# EAGLE design microcontroller (EAGLE 9.5.0)
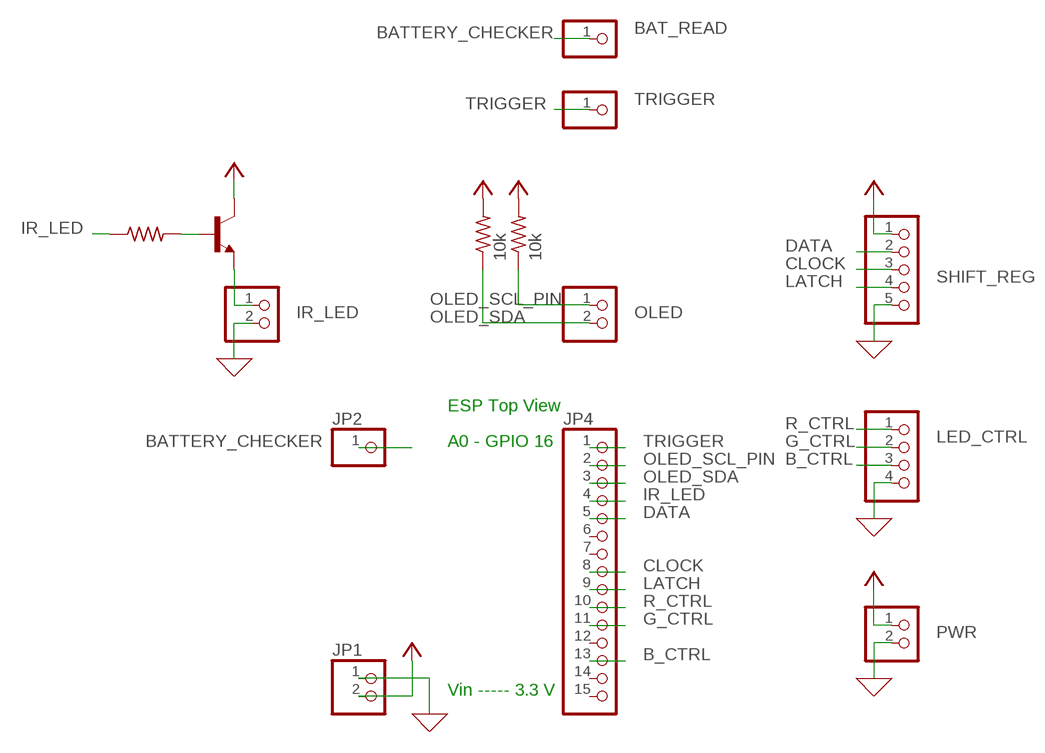
[diagram p0: schematic, sheet 1]

## Parts
BAT_READ  PINHD-1X1  [1X01]
IR_LED  PINHD-1X2  [1X02]
IR_TRS  2N5088  [TO92]
JP1  PINHD-1X2  [1X02]
JP2  PINHD-1X1  [1X01]
JP4  PINHD-1X15  [1X15]
LED_CTRL  PINHD-1X4  [1X04]
OLED  PINHD-1X2  [1X02]
PWR  PINHD-1X2  [1X02]
R1  10k  R-US_0204/7  [0204/7]
R2  10k  R-US_0204/7  [0204/7]
R3  R-US_0204/7  [0204/7]
SHIFT_REG  PINHD-1X5  [1X05]
TRIGGER  PINHD-1X1  [1X01]

## Nets
0: IR_LED.2 JP1.1 LED_CTRL.4 PWR.2 SHIFT_REG.5 ; supply symbol labelled GND
B_CTRL: JP4.13 LED_CTRL.3
BATTERY_CHECKER: BAT_READ.1 JP2.1
CLOCK: JP4.8 SHIFT_REG.3
DATA: JP4.5 SHIFT_REG.2
G_CTRL: JP4.11 LED_CTRL.2
IR_LED: JP4.4 R3.1
LATCH: JP4.9 SHIFT_REG.4
N$1: IR_LED.1 IR_TRS.3(E)
N$2: IR_TRS.2(B) R3.2
OLED_SCL_PIN: JP4.2 OLED.1 R1.1
OLED_SDA: JP4.3 OLED.2 R2.1
R_CTRL: JP4.10 LED_CTRL.1
TRIGGER: JP4.1 TRIGGER.1
VCC: IR_TRS.1(C) JP1.2 PWR.1 R1.2 R2.2 SHIFT_REG.1
Unconnected: JP4.6 JP4.7 JP4.12 JP4.14 JP4.15

## Notes on the sheet
- ESP Top View
- A0 - GPIO 16
- Vin ----- 3.3 V

## Library data of the parts
BAT_READ JP2 TRIGGER = pinhead:PINHD-1X1: PIN HEADER
IR_LED JP1 OLED PWR = pinhead:PINHD-1X2: PIN HEADER
IR_TRS = transistor-npn:2N5088: NPN Transistor
JP4 = pinhead:PINHD-1X15: PIN HEADER
LED_CTRL = pinhead:PINHD-1X4: PIN HEADER
R1-R3 = rcl:R-US_: RESISTOR, American symbol; SPICEPREFIX: R
SHIFT_REG = pinhead:PINHD-1X5: PIN HEADER

## Board
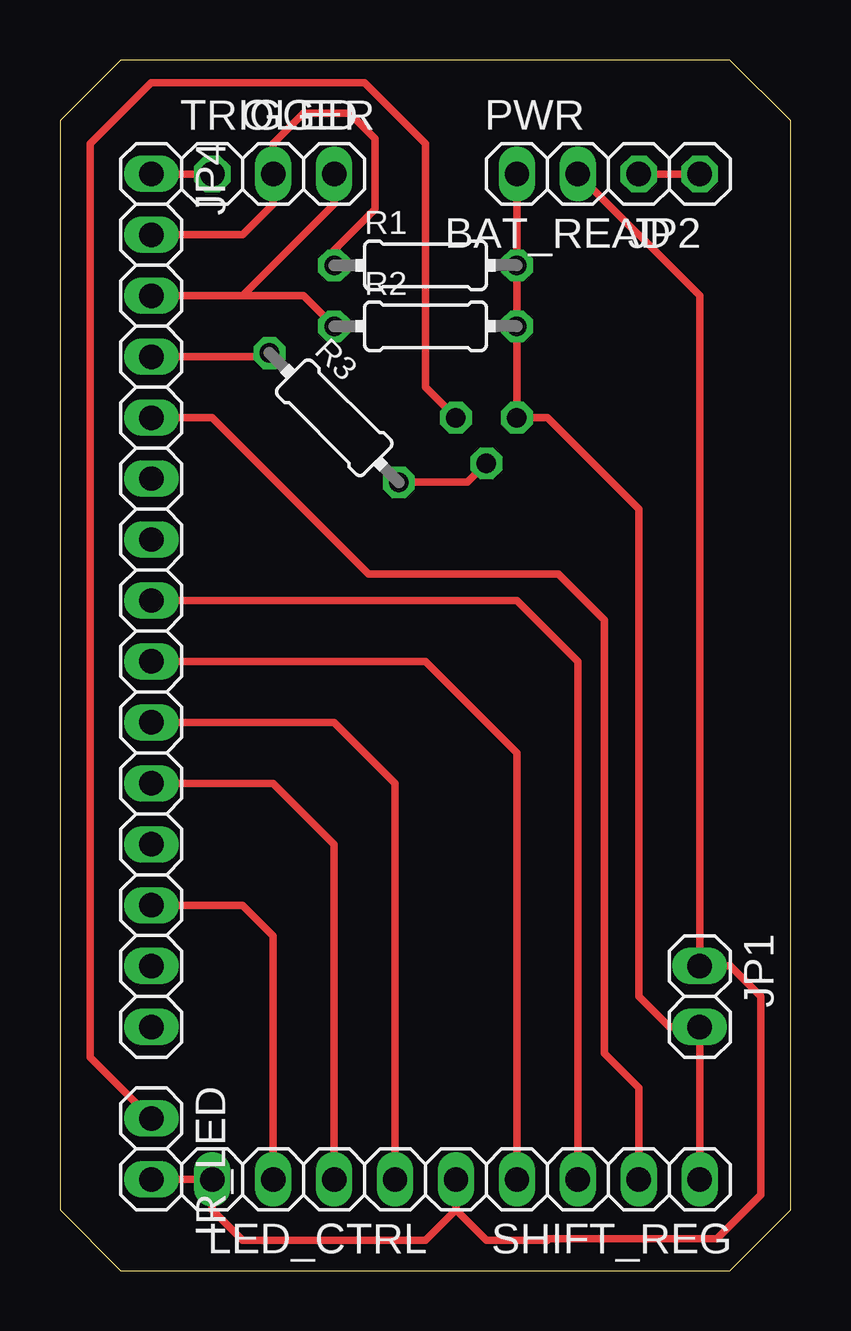
[diagram p1: board, top side]
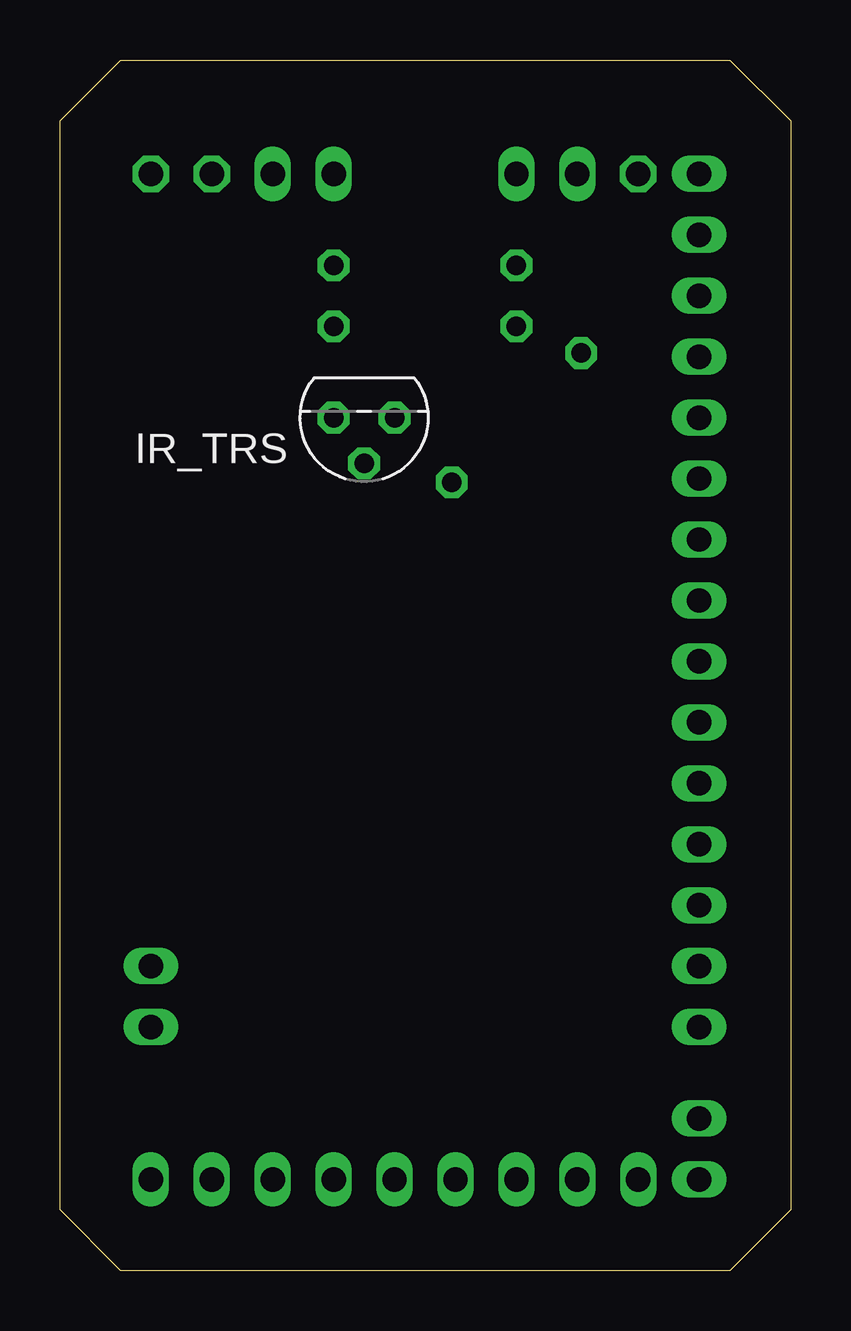
[diagram p2: board, bottom side, seen from below]

Size 30.46 x 50.47 mm. Coordinates in mm from the lower left corner, seen from the top.
Outline: 0,47.93 0,2.54 2.54,0 27.92,0 30.46,2.54 30.46,47.93 27.92,50.47 2.54,50.47 0,47.93
Copper layers (1*16): Top 0.035mm / dielectric 1.5mm / Bottom 0.035mm
Design rules "OthermillDRC_1_32_v2": minimum track width 8mil, minimum drill 0.8mm, track to track 0.794003125mm, track to pad 0.794003125mm, pad to pad 0.794003125mm, via to via 0.794003125mm, smd to smd 0mil, copper to edge 0mil, drill to drill 1mil, minimum pad ring 10mil, minimum via ring 10mil, stop-mask expansion 1mil, vias tented up to drill 30mil, thermal gap 10mil

### Footprints (pad centres in the part's own frame; a part is rotated, then mirrored left to right if it is on the bottom)
1X01 = drill 1.016 octagon: 1 0,0
1X02 = drill 1.016 long: 1 -1.27,0; 2 1.27,0
TO92 = drill 0.813 octagon: 1 1.27,0; 2 0,1.905; 3 -1.27,0
1X15 = drill 1.016 long: 1 -17.78,0; 2 -15.24,0; 3 -12.7,0; 4 -10.16,0; 5 -7.62,0; 6 -5.08,0; 7 -2.54,0; 8 0,0; 9 2.54,0; 10 5.08,0; 11 7.62,0; 12 10.16,0; 13 12.7,0; 14 15.24,0; 15 17.78,0
1X04 = drill 1.016 long: 1 -3.81,0; 2 -1.27,0; 3 1.27,0; 4 3.81,0
0204/7 = drill 0.813 octagon: 1 -3.81,0; 2 3.81,0
1X05 = drill 1.016 long: 1 -5.08,0; 2 -2.54,0; 3 0,0; 4 2.54,0; 5 5.08,0

### Placement (x,y rotation side)
BAT_READ  24.13,45.72 180 top
IR_LED  3.81,5.08 270 top
IR_TRS  17.78,35.56 180 bottom
JP1  26.67,11.43 270 top
JP2  26.67,45.72 180 top
JP4  3.81,27.94 270 top
LED_CTRL  10.16,3.81 180 top
OLED  10.16,45.72 0 top
PWR  20.32,45.72 0 top
R1  15.24,41.91 0 top
R2  15.24,39.37 0 top
R3  11.43,35.56 315 top
SHIFT_REG  21.59,3.81 180 top
TRIGGER  6.35,45.72 0 top

### Tracks (layer width: path | path; a pad name or v marks a point on that pad's centre or on a via)
0
  Top 0.305: PWR.2 26.67,40.64 JP1.1 27.94,12.7 29.21,11.43 29.21,3.17 27.38,1.34 20.39,1.34 20.32,1.27 17.78,1.27 16.51,2.54 | SHIFT_REG.5 16.51,2.54 | 16.51,2.54 15.24,1.27 7.62,1.27 6.35,2.54 LED_CTRL.4 IR_LED.2
B_CTRL
  Top 0.305: JP4.13 7.62,15.24 8.89,13.97 LED_CTRL.3
BATTERY_CHECKER
  Top 0.305: BAT_READ.1 JP2.1
CLOCK
  Top 0.305: SHIFT_REG.3 21.59,25.4 19.05,27.94 JP4.8
DATA
  Top 0.305: JP4.5 6.35,35.56 12.87,29.04 20.77,29.04 22.69,27.12 22.69,9.06 24.13,7.62 SHIFT_REG.2
G_CTRL
  Top 0.305: JP4.11 8.89,20.32 11.43,17.78 LED_CTRL.2
IR_LED
  Top 0.305: R3.1 8.58,38.1 JP4.4
LATCH
  Top 0.305: SHIFT_REG.4 19.05,21.59 15.24,25.4 JP4.9
N$1
  Top 0.305: IR_LED.1 1.27,8.89 1.27,46.99 3.81,49.53 12.7,49.53 15.24,46.99 15.24,36.83 IR_TRS.3
N$2
  Top 0.305: IR_TRS.2 16.99,32.87 R3.2
OLED_SCL_PIN
  Top 0.305: JP4.2 7.62,43.18 8.89,44.45 OLED.1 8.89,46.99 10.16,48.26 12.07,48.26 13.14,47.19 13.14,44.25 11.43,42.54 R1.1
OLED_SDA
  Top 0.305: R2.1 10.16,40.64 7.62,40.64 | 7.62,40.64 JP4.3 | OLED.2 11.43,44.45 7.62,40.64
R_CTRL
  Top 0.305: JP4.10 11.43,22.86 13.97,20.32 LED_CTRL.1
TRIGGER
  Top 0.305: TRIGGER.1 JP4.1
VCC
  Top 0.305: PWR.1 R1.2 R2.2 IR_TRS.1 20.32,35.56 24.13,31.75 24.13,11.43 25.4,10.16 JP1.2 SHIFT_REG.1